# EAGLE design was_not_root_aerialboard_rev1 (EAGLE 6.4)
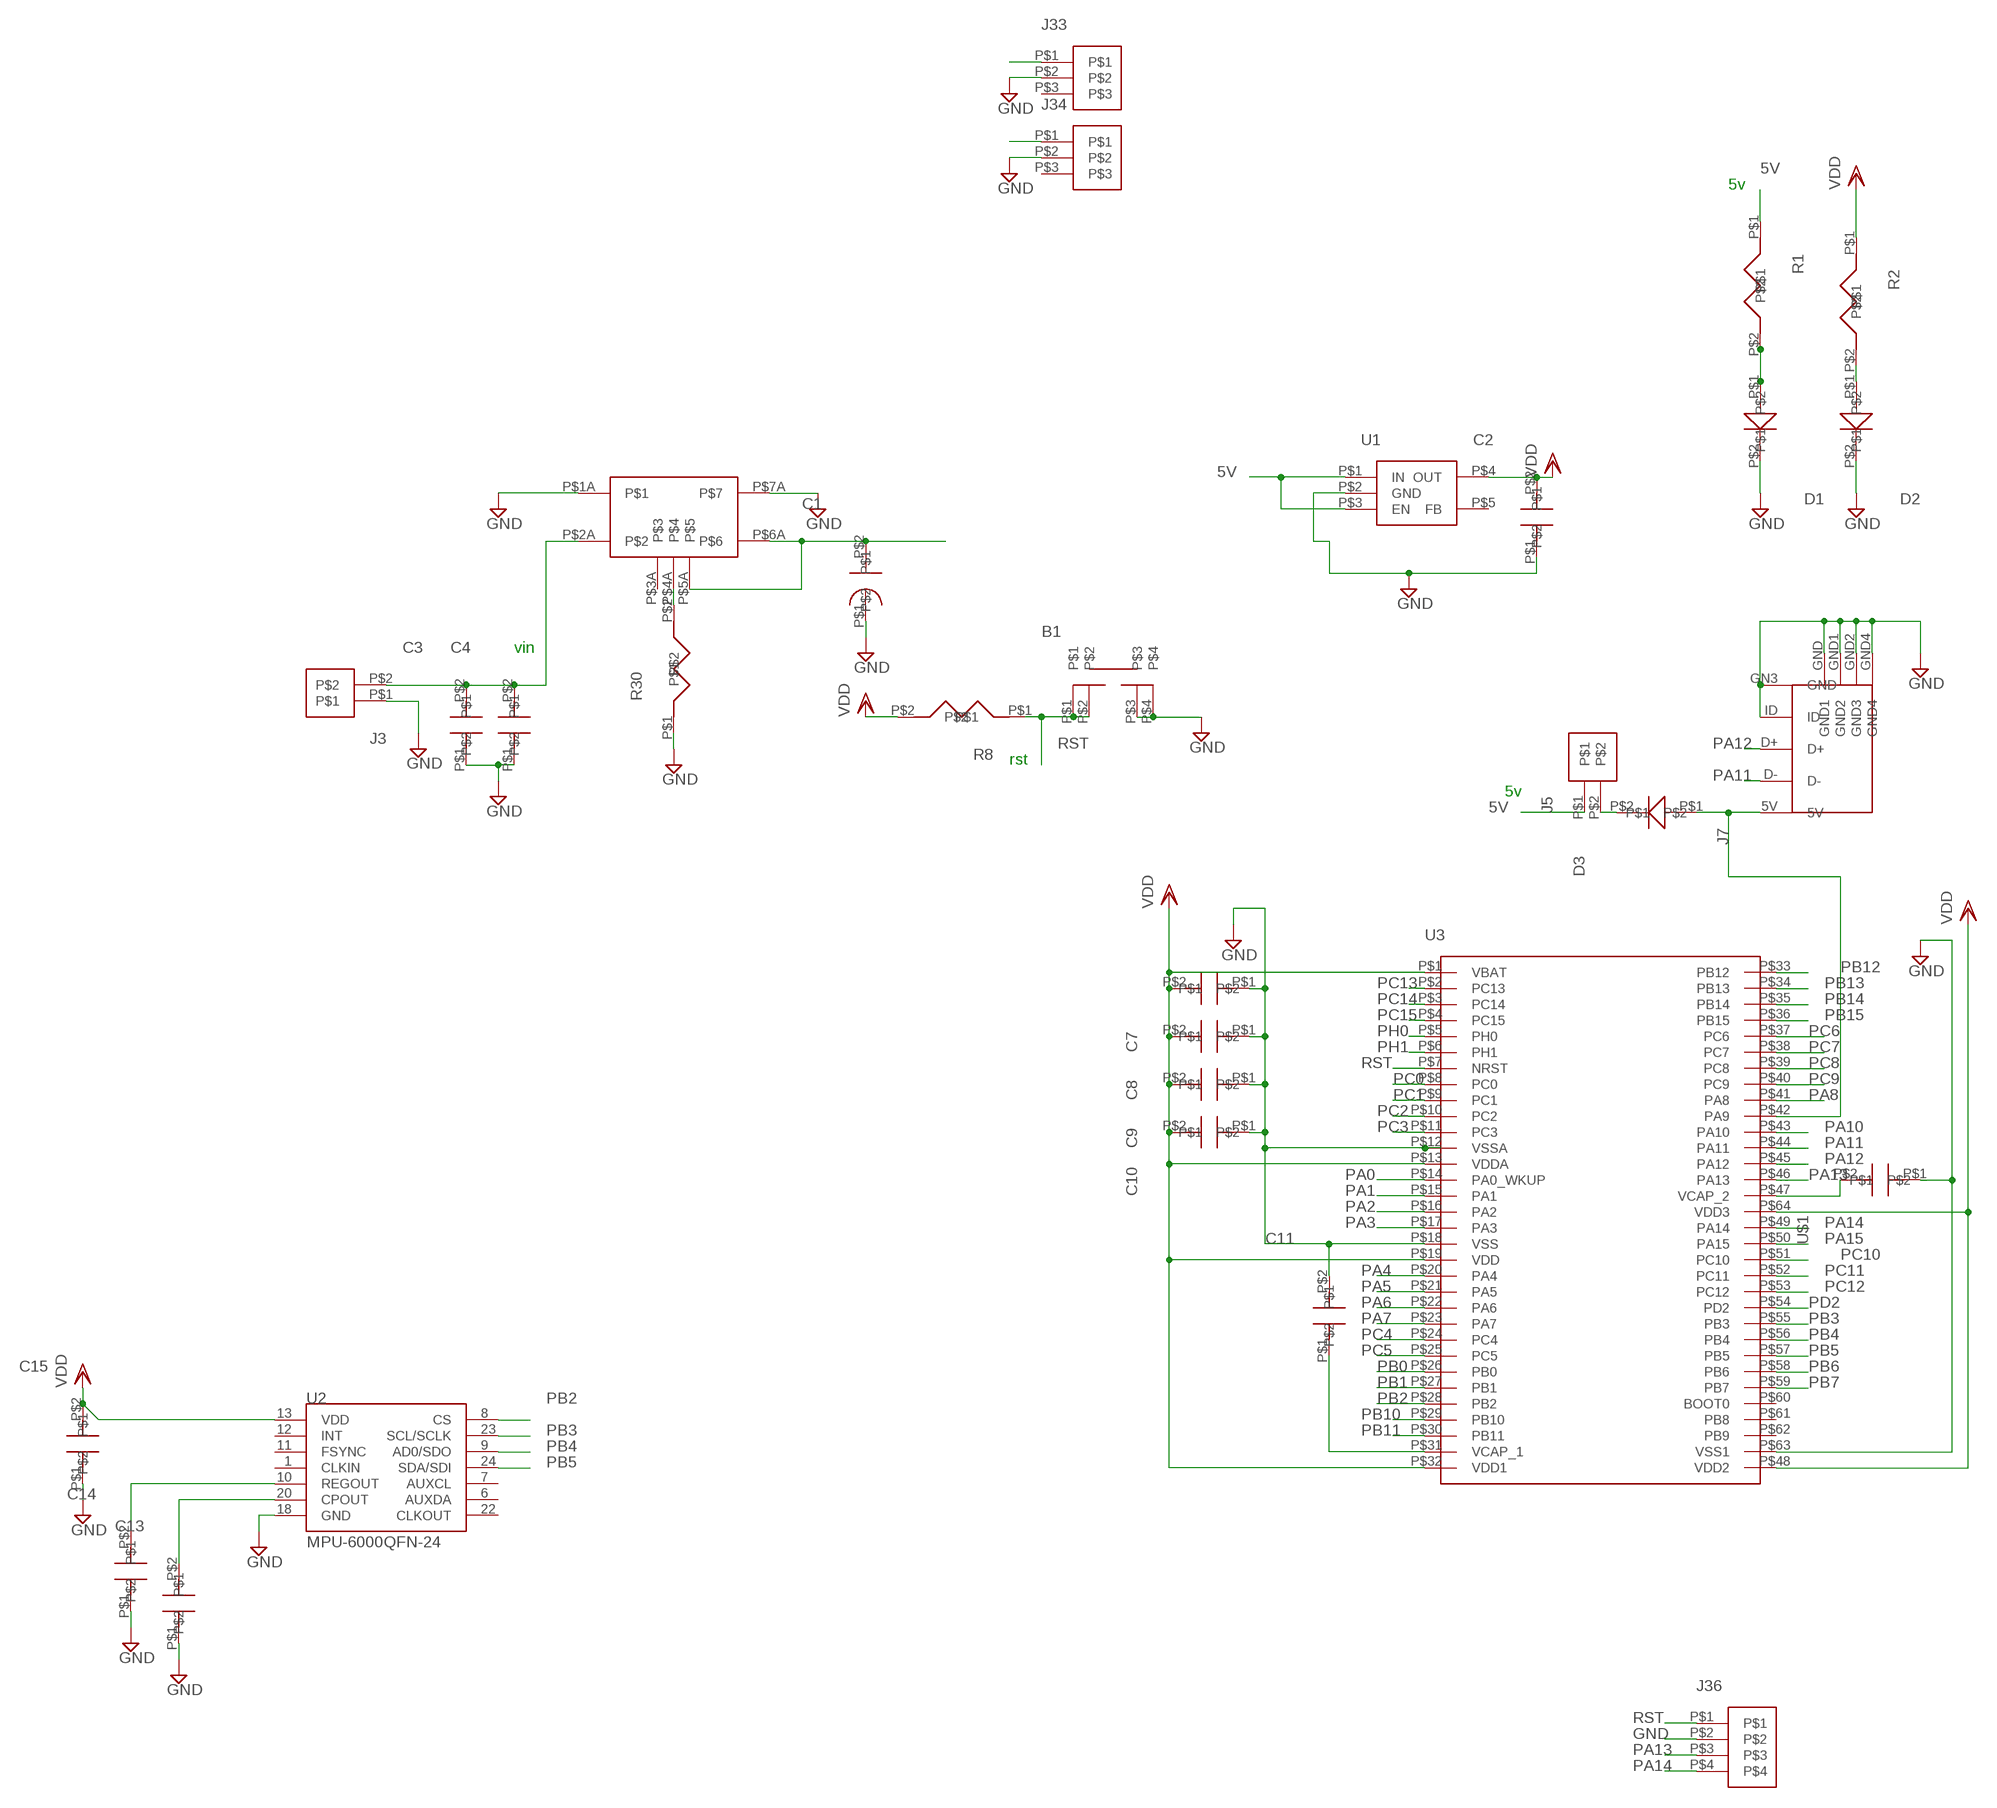
[diagram p0: schematic, sheet 1, part 1 of 2]
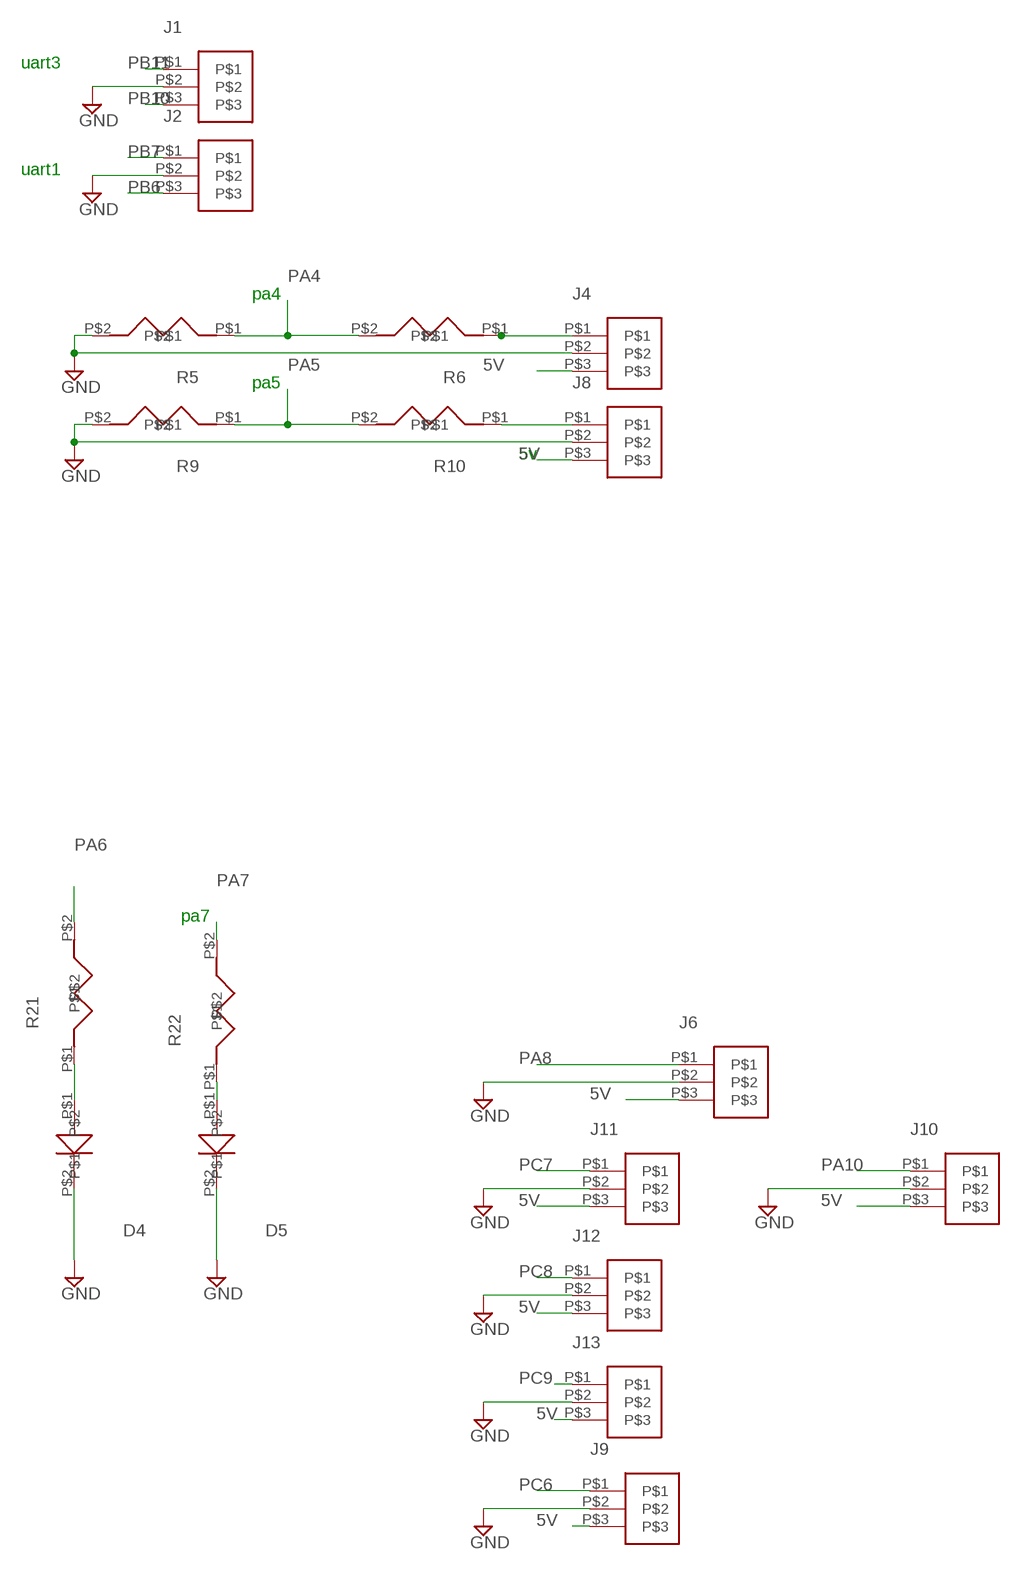
[diagram p1: schematic, sheet 1, part 2 of 2]

## Parts
B1  SM-BUTTON  [SM_BUTTON]
C1  CAPACITOR-330UF  [330UF-CAPACITOR]
C2  2.2UF-CAP  [0603-CAPACITOR]
C3  2.2UF-CAP  [0603-CAPACITOR]
C4  2.2UF-CAP  [0603-CAPACITOR]
C7  CAPACITOR-.1UF-4V  [0603-CAPACITOR]
C8  CAPACITOR-.1UF-4V  [0603-CAPACITOR]
C9  CAPACITOR-.1UF-4V  [0603-CAPACITOR]
C10  4.7UF-CAP6.3V  [0603-CAPACITOR]
C11  2.2UF-CAP  [0603-CAPACITOR]
C13  CAPACITOR-2.2NF-50V  [0603-CAPACITOR]
C14  CAPACITOR-.1UF-4V  [0603-CAPACITOR]
C15  CAPACITOR-.1UF-4V  [0603-CAPACITOR]
D1  RED_LED  [0603-CAPACITOR]
D2  RED_LED  [0603-CAPACITOR]
D3  B240A-DIODE  [DIODE-DS13004]
D4  RED_LED  [0603-CAPACITOR]
D5  ORANGE_LED  [0603-CAPACITOR]
J1  3-PIN-SHERLOCK  [3-PIN-2MM]
J2  3-PIN-SHERLOCK  [3-PIN-2MM]
J3  2-PIN-POWER  [2-PIN-3MM]
J4  3-PIN-SHERLOCK  [3-PIN-2MM]
J5  2-PIN-100MIL  [2PIN-100MIL]
J6  3-PIN-SHERLOCK  [3-PIN-2MM]
J7  USB_MINI_B  [USB_MINI_B]
J8  3-PIN-SHERLOCK  [3-PIN-2MM]
J9  3-PIN-SHERLOCK  [3-PIN-2MM]
J10  3-PIN-SHERLOCK  [3-PIN-2MM]
J11  3-PIN-SHERLOCK  [3-PIN-2MM]
J12  3-PIN-SHERLOCK  [3-PIN-2MM]
J13  3-PIN-SHERLOCK  [3-PIN-2MM]
J33  3-PIN-3MM  [3-PIN-3MM]
J34  3-PIN-3MM  [3-PIN-3MM]
J36  4-PIN-SHERLOCK  [4-PIN-2MM]
R1  RESISTOR-4.7K-25V  [0603-CAPACITOR]
R2  RESISTOR-4.7K-25V  [0603-CAPACITOR]
R5  10K_RESISTOR  [0603-CAPACITOR]
R6  10K_RESISTOR  [0603-CAPACITOR]
R8  RESISTOR-4.7K-25V  [0603-CAPACITOR]
R9  10K_RESISTOR  [0603-CAPACITOR]
R10  10K_RESISTOR  [0603-CAPACITOR]
R21  RESISTOR-4.7K-25V  [0603-CAPACITOR]
R22  RESISTOR-4.7K-25V  [0603-CAPACITOR]
R30  21K_RESISTOR  [0603-CAPACITOR]
U1  TPS73433-3.3-REG  [TPS73433-SOT5]
U2  MPU-6000QFN-24  [QFN-24-TESTING]
U3  STM32F405RG  [LQFP-64-STM32F405]
U$1  2.2UF-CAP  [0603-CAPACITOR]
U$2  WIDE_IN_REG  [WIDE_IN_REG]

## Nets
5V: C1.P$2 J4.P$3 J5.P$1 J6.P$3 J8.P$3 J9.P$3 J10.P$3 J11.P$3 J12.P$3 J13.P$3 J33.P$1 J34.P$1 R1.P$1 U1.P$1(IN) U1.P$3(EN) U$2.P$5A U$2.P$6A
GND: B1.P$3 B1.P$4 C1.P$1 C2.P$1 C3.P$1 C4.P$1 C7.P$1 C8.P$1 C9.P$1 C10.P$1 C11.P$2 C13.P$1 C14.P$1 C15.P$1 D1.P$2 D2.P$2 D4.P$2 D5.P$2 J1.P$2 J2.P$2 J3.P$1 J4.P$2 J6.P$2 J7.GN3(GND) J7.GND1(GND2) J7.GND2(GND3) J7.GND4 J7.GND(GND1) J7.ID J8.P$2 J9.P$2 J10.P$2 J11.P$2 J12.P$2 J13.P$2 J33.P$2 J34.P$2 J36.P$2 R5.P$2 R9.P$2 R30.P$1 U1.P$2(GND) U2.18(GND) U3.P$12(VSSA) U3.P$18(VSS) U3.P$63(VSS1) U$1.P$1 U$2.P$1A U$2.P$7A
N$1: C13.P$2 U2.20(CPOUT)
N$2: D3.P$2 J5.P$2
N$3: J4.P$1 R6.P$1
N$4: D4.P$1 R21.P$1
N$5: R30.P$2 U$2.P$4A
N$6: J8.P$1 R10.P$1
N$7: D5.P$1 R22.P$1
N$8: U3.P$47(VCAP_2) U$1.P$2
N$9: C11.P$1 U3.P$31(VCAP_1)
N$10: D2.P$1 R2.P$2
N$12: D1.P$1 R1.P$2
N$16: C14.P$2 U2.10(REGOUT)
PA0: U3.P$14(PA0_WKUP)
PA1: U3.P$15(PA1)
PA2: U3.P$16(PA2)
PA3: U3.P$17(PA3)
PA4: R5.P$1 R6.P$2 U3.P$20(PA4)
PA5: R9.P$1 R10.P$2 U3.P$21(PA5)
PA6: R21.P$2 U3.P$22(PA6)
PA7: R22.P$2 U3.P$23(PA7)
PA8: J6.P$1 U3.P$41(PA8)
PA9: D3.P$1 J7.5V U3.P$42(PA9)
PA10: J10.P$1 U3.P$43(PA10)
PA11: J7.D- U3.P$44(PA11)
PA12: J7.D+ U3.P$45(PA12)
PA13: J36.P$3 U3.P$46(PA13)
PA14: J36.P$4 U3.P$49(PA14)
PA15: U3.P$50(PA15)
PB0: U3.P$26(PB0)
PB1: U3.P$27(PB1)
PB2: U2.8(CS) U3.P$28(PB2)
PB3: U2.23(SCL/SCLK) U3.P$55(PB3)
PB4: U2.9(AD0/SDO) U3.P$56(PB4)
PB5: U2.24(SDA/SDI) U3.P$57(PB5)
PB6: J2.P$3 U3.P$58(PB6)
PB7: J2.P$1 U3.P$59(PB7)
PB10: J1.P$3 U3.P$29(PB10)
PB11: J1.P$1 U3.P$30(PB11)
PB12: U3.P$33(PB12)
PB13: U3.P$34(PB13)
PB14: U3.P$35(PB14)
PB15: U3.P$36(PB15)
PC0: U3.P$8(PC0)
PC1: U3.P$9(PC1)
PC2: U3.P$10(PC2)
PC3: U3.P$11(PC3)
PC4: U3.P$24(PC4)
PC5: U3.P$25(PC5)
PC6: J9.P$1 U3.P$37(PC6)
PC7: J11.P$1 U3.P$38(PC7)
PC8: J12.P$1 U3.P$39(PC8)
PC9: J13.P$1 U3.P$40(PC9)
PC10: U3.P$51(PC10)
PC11: U3.P$52(PC11)
PC12: U3.P$53(PC12)
PC13: U3.P$2(PC13)
PC14: U3.P$3(PC14)
PC15: U3.P$4(PC15)
PD2: U3.P$54(PD2)
PH0: U3.P$5(PH0)
PH1: U3.P$6(PH1)
RST: B1.P$1 B1.P$2 J36.P$1 R8.P$1 U3.P$7(NRST)
VDD: C2.P$2 C7.P$2 C8.P$2 C9.P$2 C10.P$2 C15.P$2 R2.P$1 R8.P$2 U1.P$4(OUT) U2.13(VDD) U3.P$1(VBAT) U3.P$13(VDDA) U3.P$19(VDD) U3.P$32(VDD1) U3.P$48(VDD2) U3.P$64(VDD3)
VIN: C3.P$2 C4.P$2 J3.P$2 U$2.P$2A
Unconnected: J33.P$3 J34.P$3 U1.P$5(FB) U2.1(CLKIN) U2.6(AUXDA) U2.7(AUXCL) U2.11(FSYNC) U2.12(INT) U2.22(CLKOUT) U3.P$60(BOOT0) U3.P$61(PB8) U3.P$62(PB9) U$2.P$3A

## Notes on the sheet
- 5v
- uart3
- uart1
- vin
- pa4
- pa5
- rst
- 5v
- 5v
- pa7

## Library data of the parts
B1 = aerial:SM-BUTTON
C1 = aerial:CAPACITOR-330UF
C2-C4 C11 U$1 = aerial:2.2UF-CAP
C7-C9 C14 C15 = aerial:CAPACITOR-.1UF-4V
C10 = aerial:4.7UF-CAP6.3V
C13 = aerial:CAPACITOR-2.2NF-50V
D1 D2 D4 = aerial:RED_LED
D3 = aerial:B240A-DIODE
D5 = aerial:ORANGE_LED
J1 J2 J4 J6 J8-J13 = aerial:3-PIN-SHERLOCK
J3 = aerial:2-PIN-POWER
J5 = aerial:2-PIN-100MIL
J7 = aerial:USB_MINI_B
J33 J34 = aerial:3-PIN-3MM
J36 = aerial:4-PIN-SHERLOCK
R1 R2 R8 R21 R22 = aerial:RESISTOR-4.7K-25V
R5 R6 R9 R10 = aerial:10K_RESISTOR
R30 = aerial:21K_RESISTOR
U1 = aerial:TPS73433-3.3-REG
U2 = SparkFun-Sensors:MPU-6000: MPU-6000 - I2C address is 0x68 with AD0 low and 0x69 with AD0 high.
U3 = aerial:STM32F405RG
U$2 = aerial:WIDE_IN_REG

## Board
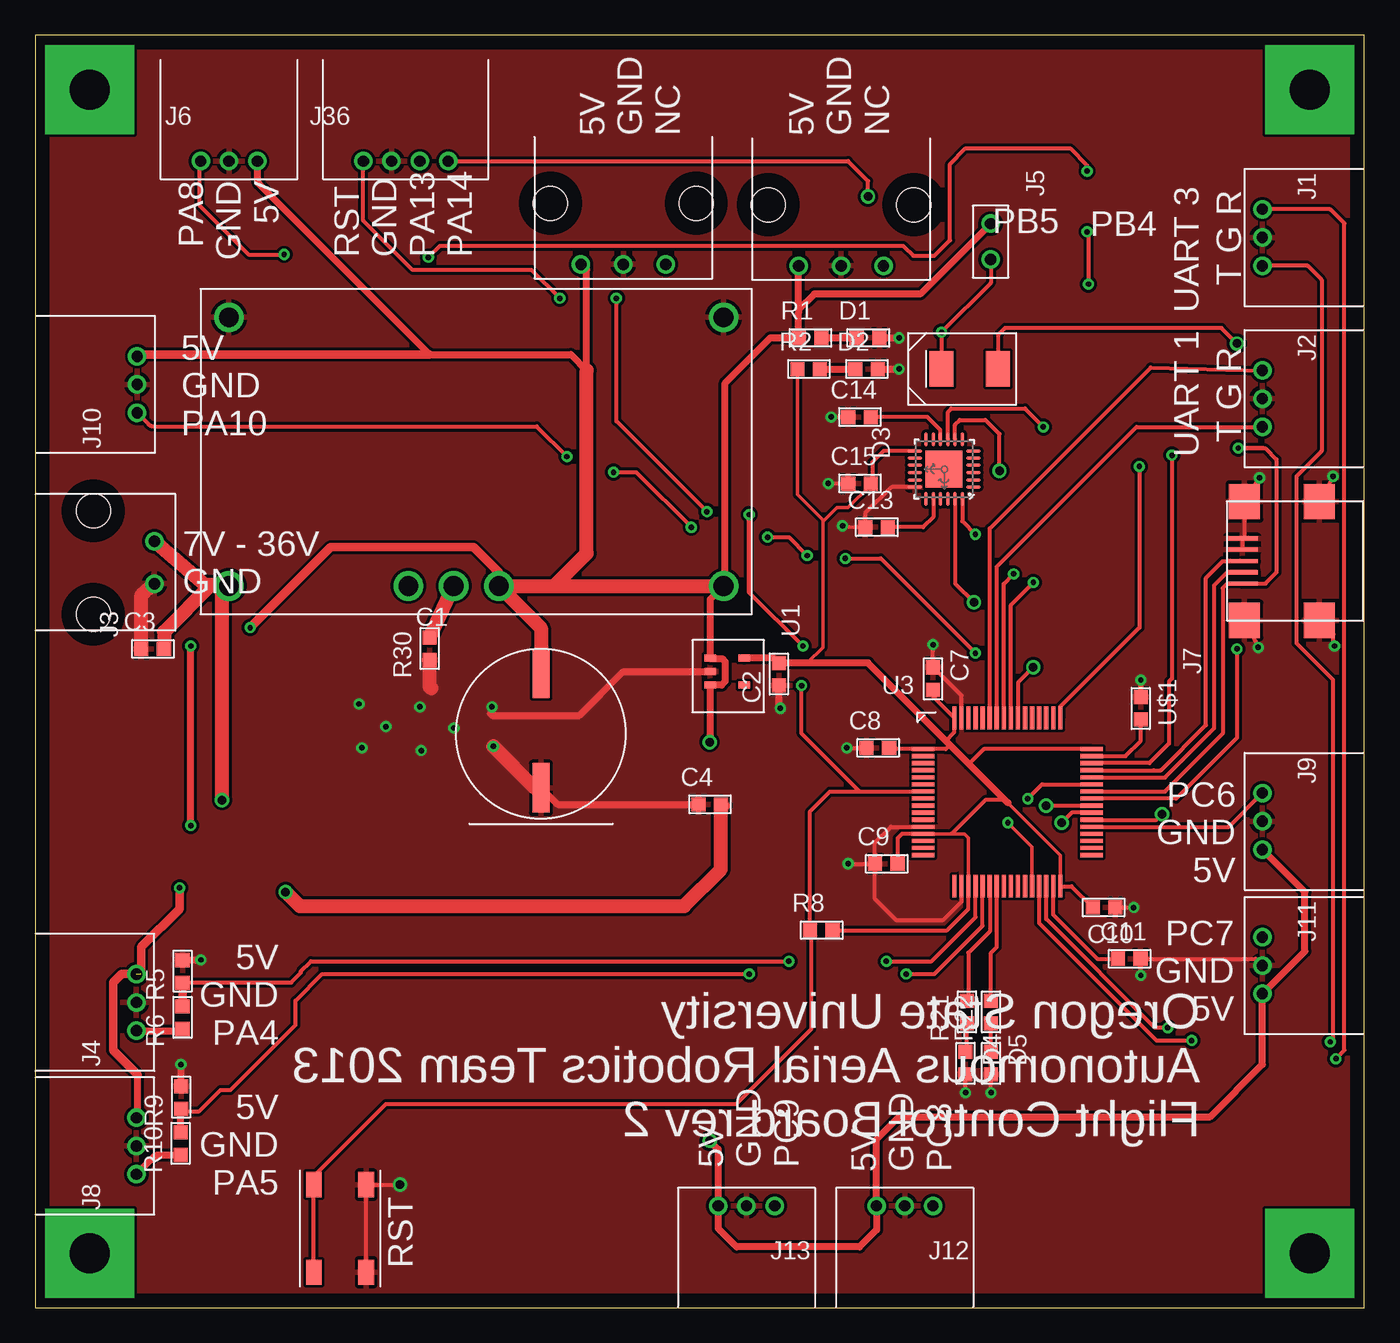
[diagram p2: board, top side]
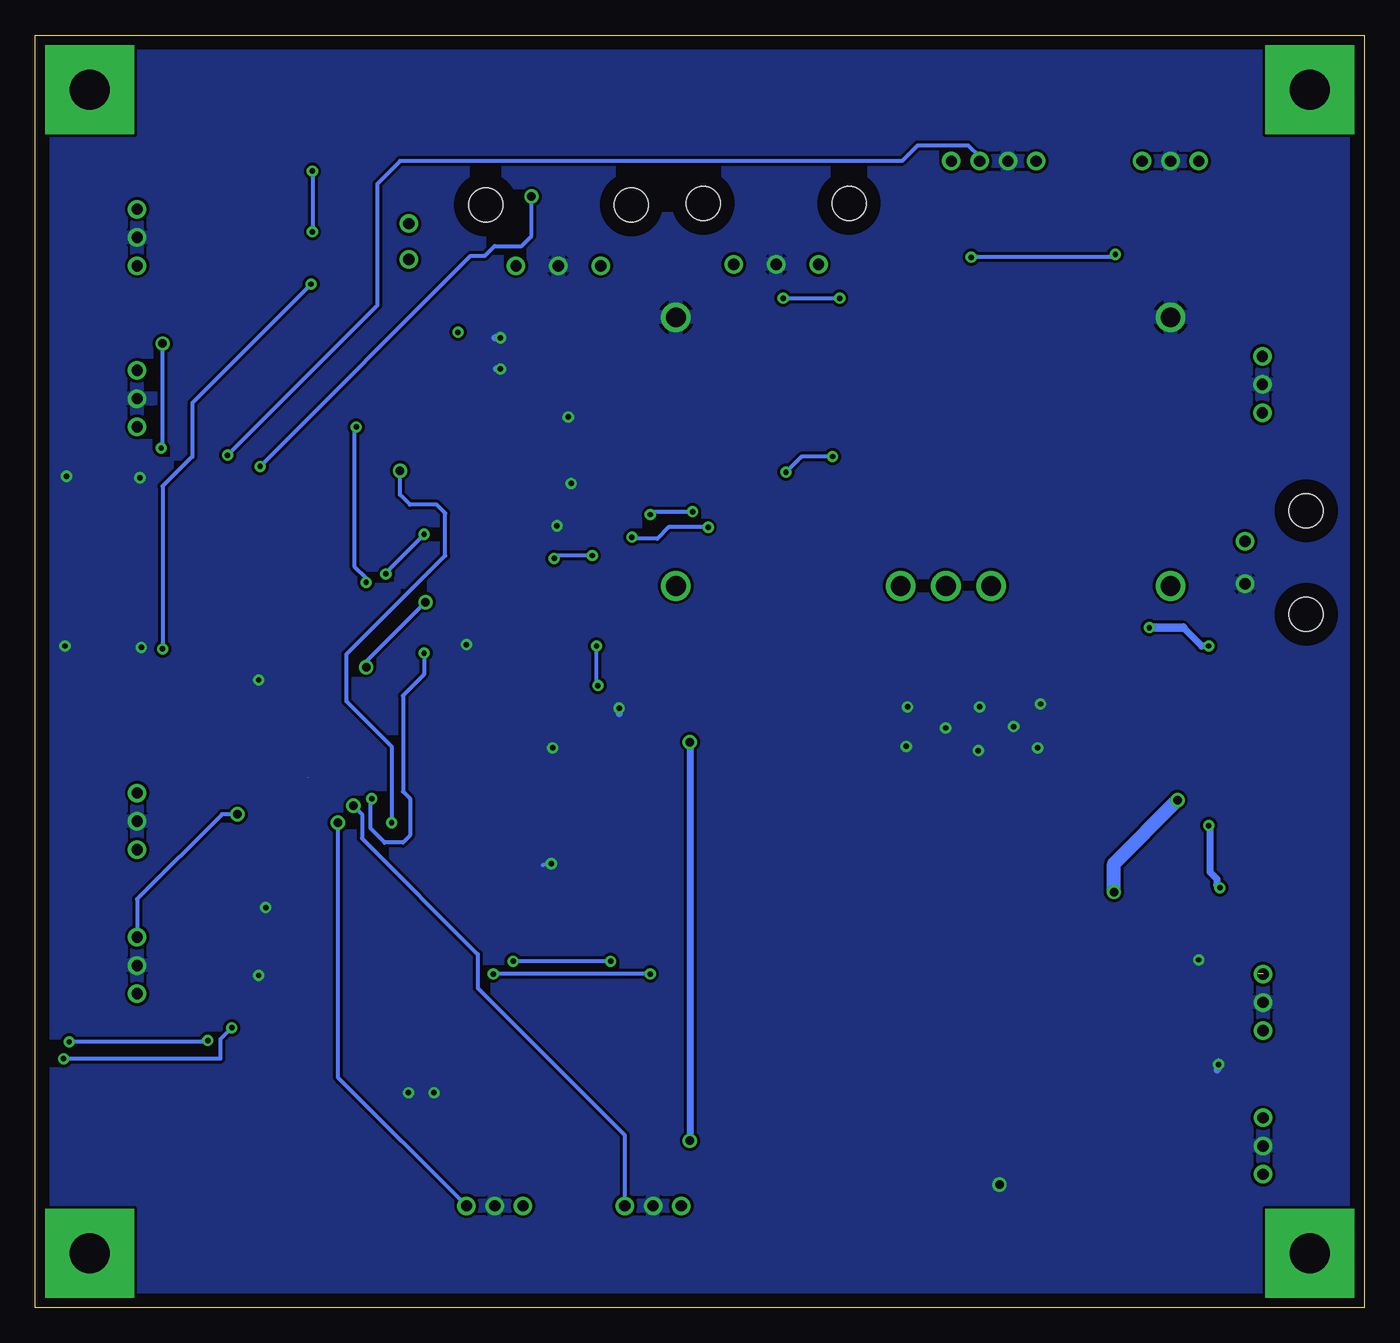
[diagram p3: board, bottom side, seen from below]

Size 94 x 90 mm. Coordinates in mm from the lower left corner, seen from the top.
Outline: 0,0 94,0 94,90 0,90 0,0
Copper layers (1*16): Top 0.035mm / dielectric 1.5mm / Bottom 0.035mm
Design rules "default": minimum track width 10mil, minimum drill 24mil, track to track 8mil, track to pad 8mil, pad to pad 8mil, via to via 8mil, smd to smd 8mil, copper to edge 40mil, drill to drill 8mil, minimum pad ring 10mil, minimum via ring 8mil, stop-mask expansion 4mil, vias tented up to drill 0mil, thermal gap 10mil

### Footprints (pad centres in the part's own frame; a part is rotated, then mirrored left to right if it is on the bottom)
SM_BUTTON = smd 1.8 x 1.1: P$1 0,0; P$2 6.2,0; P$3 0,3.7; P$4 6.2,3.7
330UF-CAPACITOR = smd 1.2 x 3.5: P$1 0,0; P$2 0,8.1
0603-CAPACITOR = smd 1 x 1: P$1 0,0; P$2 1.6,0
DIODE-DS13004 = smd 2.5 x 1.7: P$1 0,0; P$2 0,4
3-PIN-2MM = drill 0.8: P$1 0,0; P$2 2,0; P$3 4,0
2-PIN-3MM = drill 0.8: P$1 0,0; P$2 3,0 | hole 2.41: -2.16,4.32; 5.15,4.32
2PIN-100MIL = drill 0.8: P$1 0,0; P$2 2.54,0
USB_MINI_B = smd 0.3 x 2.2: 5V 2.6,8.55; D+ 4.2,8.55; D- 3.4,8.55; GND 5.8,8.55; ID 5,8.55 | smd 2.5 x 2.2: GN3 8.4,3.1; GND1 0,8.4; GND2 0,3.1; GND4 8.4,8.4
3-PIN-3MM = drill 0.8: P$1 0,0; P$2 3,0; P$3 6,0 | hole 2.41: -2.16,4.32; 8.15,4.32
4-PIN-2MM = drill 0.8: P$1 0,0; P$2 2,0; P$3 4,0; P$4 6,0
TPS73433-SOT5 = smd 0.5 x 0.8: P$1 0,0; P$2 0.95,0; P$3 1.9,0; P$4 0,2.4; P$5 1.9,2.4
QFN-24-TESTING = smd 1.016 x 0.254: 1 -2.066,1.257; 2 -2.066,0.75; 3 -2.066,0.247; 4 -2.066,-0.287; 5 -2.066,-0.792; 6 -2.066,-1.297; 13 2.086,-1.297; 14 2.086,-0.792; 15 2.086,-0.287; 16 2.086,0.247; 17 2.086,0.75; 18 2.086,1.257 | smd 0.254 x 1.016: 7 -1.267,-2.122; 8 -0.762,-2.122; 9 -0.258,-2.122; 10 0.278,-2.122; 11 0.78,-2.122; 12 1.287,-2.122; 19 1.287,2.082; 20 0.78,2.082; 21 0.278,2.082; 22 -0.258,2.082; 23 -0.762,2.082; 24 -1.267,2.082 | smd 2.616 x 2.616: P$1 0.02,-0.01
LQFP-64-STM32F405 = smd 1.6 x 0.3: P$1 0.4,10.1; P$2 0.4,9.6; P$3 0.4,9.1; P$4 0.4,8.6; P$5 0.4,8.1; P$6 0.4,7.6; P$7 0.4,7.1; P$8 0.4,6.6; P$9 0.4,6.1; P$10 0.4,5.6; P$11 0.4,5.1; P$12 0.4,4.6; P$13 0.4,4.1; P$14 0.4,3.6; P$15 0.4,3.1; P$16 0.4,2.6; P$33 12.3,2.6; P$34 12.3,3.1; P$35 12.3,3.6; P$36 12.3,4.1; P$37 12.3,4.6; P$38 12.3,5.1; P$39 12.3,5.6; P$40 12.3,6.1; P$41 12.3,6.6; P$42 12.3,7.1; P$43 12.3,7.6; P$44 12.3,8.1; P$45 12.3,8.6; P$46 12.3,9.1; P$47 12.3,9.6; P$48 12.3,10.1 | smd 0.3 x 1.6: P$17 2.6,0.4; P$18 3.1,0.4; P$19 3.6,0.4; P$20 4.1,0.4; P$21 4.6,0.4; P$22 5.1,0.4; P$23 5.6,0.4; P$24 6.1,0.4; P$25 6.6,0.4; P$26 7.1,0.4; P$27 7.6,0.4; P$28 8.1,0.4; P$29 8.6,0.4; P$30 9.1,0.4; P$31 9.6,0.4; P$32 10.1,0.4; P$49 10.1,12.3; P$50 9.6,12.3; P$51 9.1,12.3; P$52 8.6,12.3; P$53 8.1,12.3; P$54 7.6,12.3; P$55 7.1,12.3; P$56 6.6,12.3; P$57 6.1,12.3; P$58 5.6,12.3; P$59 5.1,12.3; P$60 4.6,12.3; P$61 4.1,12.3; P$62 3.6,12.3; P$63 3.1,12.3; P$64 2.6,12.3
WIDE_IN_REG = drill 1.4: P$1A 2,21; P$2A 2,2; P$3A 14.7,2; P$4A 17.9,2; P$5A 21.1,2; P$6A 37,2; P$7A 37,21

### Placement (x,y rotation side)
B1  19.7,8.7 270 top
C1  35.77,36.77 0 top
C2  52.6,44 90 top
C3  7.5,46.6 0 top
C4  46.9,35.6 0 top
C7  63.5,45.3 270 top
C8  58.8,39.6 0 top
C9  59.4,31.4 0 top
C10  76.4,28.3 180 top
C11  76.58,24.68 0 top
C13  58.7,55.2 0 top
C14  57.5,63 0 top
C15  57.5,58.3 0 top
D1  58.1,68.6 0 top
D2  58,66.4 0 top
D3  68.1,66.4 90 top
D4  65.8,18.1 270 top
D5  67.6,18.1 270 top
J1  86.8,77.7 270 top
J2  86.8,66.3 270 top
J3  8.42,51.21 90 top
J4  7.15,19.59 90 top
J5  67.58,76.68 270 top
J6  11.7,81.1 0 top
J7  93.93,48.62 90 top
J8  7.15,9.43 90 top
J9  86.8,36.4 270 top
J10  7.2,63.3 90 top
J11  86.8,26.2 270 top
J12  63.5,7.2 180 top
J13  52.3,7.2 180 top
J33  54,73.7 0 top
J34  38.6,73.8 0 top
J36  23.2,81.1 0 top
R1  54,68.6 0 top
R2  53.9,66.4 0 top
R5  10.41,22.98 90 top
R6  10.41,19.7 90 top
R8  54.8,26.7 0 top
R9  10.31,14.06 90 top
R10  10.27,10.8 90 top
R21  65.9,20.1 90 top
R22  67.6,20.1 90 top
R30  27.9,45.8 90 top
U1  47.74,45.94 270 top
U2  64.3,59.3 180 top
U3  62.41,29.41 0 top
U$1  78.2,43.2 270 top
U$2  11.69,49.05 0 top

### Tracks (layer width: path | path; a pad name or v marks a point on that pad's centre or on a via)
5V  (via drill 0.38, 0.6)  (2 unrouted)
  Top 0.3: J10.P$3 arc-45 7.49,67.42
  Top 0.5: v11,34.1 v11,46.8 | J6.P$3 15.7,79.83 arc45 15.85,79.47 27.9,67.42 37.88,67.42 39,66.3 39,73.4 J34.P$1 | J8.P$3 arc45 7.25,13.67 7.25,16.45 | v47.7,40 47.74,40.04 U1.P$3 48.54,44.04 48.8,44.3 48.8,45.7 48.6,45.9 47.78,45.9 U1.P$1 47.74,50.1 U$2.P$6A 48.8,51.16 48.8,65.4 52,68.6 R1.P$1 54,70.4 54,70.6 | v47.7,11.8 48.3,11.2 J13.P$3 48.3,5.6 49.6,4.3 58.3,4.3 59.5,5.5 J12.P$3 59.5,11.9 61.1,13.5 83.1,13.5 86.8,17.2 J11.P$3 89.8,25.2 89.8,29.4 J9.P$3 | 54,70.6 J33.P$1 | J5.P$1 62.6,71.7 55.1,71.7 54,70.6
  Top 0.6: U$2.P$5A 32.79,52.01 31,53.8 20.9,53.8 v15.2,48.1 | 7.25,16.45 5.5,18.2 5.5,23 6.1,23.6 7.44,23.6 | 27.9,67.42 7.49,67.42 | v10.2,29.7 10.2,28.2 7.5,25.5 7.5,23.64
  Top 1: C1.P$2 35.77,48.07 U$2.P$5A 36.7,51.05 | 36.7,51.05 U$2.P$6A | 36.7,51.05 39,53.35 39,66.3
  Bottom 0.5: 10.4,29.9 10.4,30.3 10.9,30.8 10.9,34 v11,34.1 | v11,46.8 11.5,46.8 12.8,48.1 | v47.7,40 v47.7,11.8
  Bottom 0.6: 12.8,48.1 v15.2,48.1 | v10.2,29.7 10.4,29.9
GND  (via drill 0.38, 0.6)
  Top 0.25: C14.P$1 v56.3,63 | C15.P$1 v56.1,58.3 | C13.P$1 57.2,55.2 v57.1,55.3
  Top 0.3: U3.P$63 65.51,43.29 C7.P$1 v63.5,46.9 | v57.4,39.6 C8.P$1 | U3.P$12 60.51,34.01 59.4,32.9 C9.P$1 | C10.P$1 v77.7,28.3 | v65.8,15.2 D4.P$2 | v67.6,15.2 D5.P$2 | v57.5,31.4 C9.P$1 | J7.GND1 86.53,46.73 v86.5,46.7 | v91.9,46.8 91.83,46.87 91.83,47.62 J7.GND2 | 86.38,56.87 J7.GND4 | J7.GND4 86.53,58.63 v86.6,58.7 | J7.GN3 91.83,58.77 v91.8,58.8 | B1.P$4 B1.P$3 v25.8,8.7 | v78.2,23.5 78.18,23.52 C11.P$2 86.32,24.68 J11.P$2 | U2.18 60.54,58.04 58.7,56.2 C13.P$1 | U3.P$18 65.51,28.71 64.2,27.4 60.9,27.4 59.4,28.9 C9.P$1 | J7.GND4 85.53,54.57 J7.GND J7.ID
  Top 0.406: U$1.P$1 v78.2,44.4
  Top 0.5: U1.P$2 41.59,44.99 38.5,41.9 32.3,41.9 32.2,42 | C4.P$1 36.94,35.6 C1.P$1 | C2.P$1 52.6,42.5 v52.7,42.4 | D1.P$2 v61.1,68.6 | D2.P$2 v61.1,66.4 | R9.P$2 10.31,16.49 v10.3,17.2 | R5.P$2 11.68,24.58 v11.7,24.6
  Top 1: R30.P$1 27.9,43.9 28,43.8 | C1.P$1 35.33,36.77 v32.4,39.7 | C3.P$1 7.5,50.39 J3.P$1
  Bottom 0.25: v56.3,63 56.1,63 | v56.1,58.3 56,58.3 | v57.1,55.3 57,55.3
  Bottom 0.3: v63.5,46.9 63.5,47.1 | v57.4,39.6 57.2,39.6 | v77.7,28.3 77.8,28.3 | v65.8,15.2 65.8,15 | v67.6,15.2 67.6,15.1 | v57.5,31.4 58.1,31.3 | v86.5,46.7 86.5,46.5 | v91.9,46.8 91.9,46.5 | v86.6,58.7 86.6,58.9 | v91.8,58.8 91.8,58.9 | v78.2,23.5 78.2,23.3
  Bottom 0.406: v78.2,44.4 78.2,44.5
  Bottom 0.5: v52.7,42.4 52.7,42 | v61.1,68.6 61.5,68.6 | v61.1,66.4 61.4,66.4 | v10.3,17.2 10.3,17.4 10.4,16.8 | v11.7,24.6 11.8,24.6
  other vias: 23.1,39.6 22.9,42.7 24.8,41.1 27.3,39.4 27.2,42.5 29.6,41 32.3,42.5
  pour Bottom: 0.5,89.5 93.5,89.5 93.5,0.5 0.5,0.5
  pour Top: 21.4,43.9 33.9,43.9 33.9,38.2 21.4,38.2
  pour Top: 22.2,40.5 22.2,41.6 22.2,42
  pour Top: 0.5,0.5 93.5,0.5 93.5,89.5 0.5,89.5
N$1
  Top 0.3: U2.20 63.52,55.92 62.8,55.2 C13.P$2
N$2  (via drill 0.38)
  Top 0.3: D3.P$2 v64.1,69 67.58,72.48 J5.P$2
  Bottom 0.3: 64.1,69.14 v64.1,69
N$3
  Top 0.5: J4.P$1 10.3,19.59 R6.P$1
N$4
  Top 0.3: R21.P$1 65.9,18.2 D4.P$1
N$5
  Top 1: R30.P$2 U$2.P$4A
N$6
  Top 0.5: J8.P$1 8.37,10.65 arc-45 8.73,10.8 R10.P$1
N$7
  Top 0.3: D5.P$1 R22.P$1
N$8
  Top 0.3: U3.P$47 77.11,39.01 78.2,40.1 U$1.P$2
N$9
  Top 0.3: U3.P$31 72.01,27.79 75.12,24.68 C11.P$1
N$10
  Top 0.5: R2.P$2 D2.P$1
N$12
  Top 0.5: R1.P$2 D1.P$1
N$13  (via drill 2.84 pad 6.3)
  other vias: 3.85,86.15
N$14  (via drill 2.84 pad 6.3)
  other vias: 3.85,3.85
N$16
  Top 0.3: U2.10 64.02,62.08 63.1,63 C14.P$2
N$17  (via drill 2.84 pad 6.3)
  other vias: 90.15,86.15
N$18  (via drill 2.84 pad 6.3)
  other vias: 90.15,3.85
PA4  (via drill 0.38)
  Top 0.3: U3.P$20 66.51,27.61 63.4,24.5 v60.2,24.5 | v53.3,24.5 19.5,24.5 18.78,23.78 18.78,23.68 18.1,23 10.43,23 R5.P$1
  Top 0.6: R6.P$2 R5.P$1
  Bottom 0.3: v53.3,24.5 v60.2,24.5
PA5  (via drill 0.38)
  Top 0.3: U3.P$21 67.01,27.01 63.6,23.6 v61.6,23.6 | v50.5,23.6 20.3,23.6 18.4,21.7 18.4,20 13.8,15.4 13.1,15.4 11.6,13.9 10.35,13.9 R9.P$1
  Top 0.5: R10.P$2 10.27,13.82 R9.P$1
  Bottom 0.3: v50.5,23.6 v61.6,23.6
PA6
  Top 0.3: U3.P$22 67.51,26.61 66,25.1 66,21.8 R21.P$2
PA7
  Top 0.3: U3.P$23 68.01,25.51 67.6,25.1 R22.P$2
PA8  (via drill 0.38)
  Top 0.3: U3.P$41 80.71,36.01 85,40.3 v85,46.6 | v74.5,72.4 74.5,76 v74.4,76.1 | 27.9,74.4 v27.8,74.3 28.6,75.1 61.4,75.1 62.1,74.4 63.6,74.4 64.7,75.5 64.7,80.9 65.8,82 73.2,82 74.4,80.8 v74.4,80.4 | v17.6,74.5 15.09,74.5 11.6,77.99 11.6,80.86 arc-45 J6.P$1
  Bottom 0.3: v85,46.6 85,58.1 82.9,60.2 82.9,64 v74.5,72.4 | v27.8,74.3 17.8,74.3 v17.6,74.5 | v74.4,80.4 v74.4,76.1
PA9  (via drill 0.38, 0.6 pad 0.41)
  Top 0.3: U3.P$42 79.91,36.51 84,40.6 84,50.9 84.32,51.22 J7.5V 87.02,51.22 87.8,52 87.8,60 87,60.8 v85.1,60.8 86.9,60.8 | 67.9,66.6 D3.P$1 68.1,68.8 68.6,69.3 83.9,69.3 v85,68.2
  Bottom 0.3: v85,68.2 85,60.9 v85.1,60.8
PA10  (via drill 0.38)
  Top 0.3: v37.6,60.2 35.46,62.34 8.37,62.34 arc-45 8.01,62.49 J10.P$1 | v40.9,59.1 42.5,59.1 v46.4,55.2 | v51.8,54.5 53.3,54.5 v54.6,53.2 | v57.3,53 59.8,53 v66.5,46.3 | 70.3,36.2 70.2,36.1 v70.2,36 71.21,37.01 U3.P$43
  Bottom 0.3: v37.6,60.2 39.8,60.2 v40.9,59.1 | v46.4,55.2 49.2,55.2 50,54.4 51.7,54.4 v51.8,54.5 | v54.6,53.2 57.1,53.2 v57.3,53 | v66.5,46.3 66.5,44.8 68,43.3 68,36.5 67.5,36 67.5,33.4 68,32.9 69.3,32.9 70.3,33.9 70.3,35.9 v70.2,36
PA11  (1 unrouted)
  Top 0.3: U3.P$44 | U3.P$44 79.9,37.5 83.4,41 83.4,51.1 84.3,52 86.36,52 J7.D-
PA12
  Top 0.3: U3.P$45 79.09,38.01 79.1,38 79.6,38 82.8,41.2 82.8,51.6 84,52.8 86.36,52.8 J7.D+
PA13  (via drill 0.38)
  Top 0.3: U3.P$46 78.81,38.51 80.2,39.9 80.2,44.3 80.4,44.5 v80.4,60.3
  Bottom 0.3: J36.P$3 27.2,81.4 28,82.2 31.6,82.2 32.7,81.1 68.2,81.1 69.8,79.5 69.8,70.9 v80.4,60.3
PA14  (via drill 0.38, 0.6)
  Top 0.3: U3.P$49 72.51,42.51 78.1,48.1 v78.1,59.5 | J36.P$4 57.5,81.1 58.9,79.7 v58.9,78.6
  Bottom 0.3: v78.1,59.5 63.2,74.4 62.2,74.4 61.5,75.1 59.6,75.1 58.9,75.8 v58.9,78.6
PB2  (via drill 0.38, 0.6)
  Top 0.25: U3.P$28 70.51,32.59 v68.8,34.3
  Top 0.3: v68.2,59.2 68.2,61.8 67.2,62.8 65.4,62.8 65.06,62.46 U2.8
  Bottom 0.3: v68.2,59.2 68.2,57.5 67.5,56.8 65.6,56.8 65,56.2 65,53.2 72,46.2 72,42.9 68.8,39.7 v68.8,34.3
PB3  (via drill 0.6)
  Top 0.3: U2.23 65.06,51.24 v66.4,49.9 | v70.6,45.3 69.51,44.21 U3.P$55
  Bottom 0.3: v66.4,49.9 70.6,45.7 v70.6,45.3
PB4  (via drill 0.38)
  Top 0.3: U3.P$56 69.01,49.71 v70.6,51.3 | v71.3,62.3 70,63.6 64.8,63.6 64.56,63.36 U2.9
  Bottom 0.3: v70.6,51.3 70.6,51.6 71.4,52.4 71.4,62.2 v71.3,62.3
PB5  (via drill 0.38)
  Top 0.3: U3.P$57 68.51,51.19 68.5,51.2 v69.2,51.9 | U2.24 65.57,55.63 v66.5,54.7
  Bottom 0.3: v69.2,51.9 69.2,52 v66.5,54.7
PB6
  Top 0.3: U3.P$58 68.01,52.41 77.9,62.3 J2.P$3
PB7
  Top 0.3: U3.P$59 67.51,55.11 78.9,66.5 J2.P$1
PB10  (via drill 0.38)
  Top 0.3: U3.P$29 71.01,27.19 79.3,18.9 v81.8,18.9 | v91.6,18.8 91.8,19 91.8,44.4 89.2,47 89.2,58.8 91,60.6 91,72.7 90,73.7 J1.P$3
  Bottom 0.3: v91.6,18.8 81.9,18.8 v81.8,18.9
PB11  (via drill 0.38)
  Top 0.3: U3.P$30 71.51,27.49 79.2,19.8 v80.1,19.8 | v92,17.6 92.6,18.2 92.6,76.7 91.6,77.7 J1.P$1
  Bottom 0.3: v92,17.6 80.9,17.6 80.9,19 v80.1,19.8
PC6
  Top 0.3: U3.P$37 84.41,34.01 J9.P$1
PC7  (via drill 0.6)
  Top 0.3: U3.P$38 79.31,34.51 v79.7,34.9
  Bottom 0.3: v79.7,34.9 80.8,34.9 86.8,28.9 J11.P$1
PC8  (via drill 0.6)
  Top 0.3: U3.P$39 73.31,35.01 v72.6,34.3
  Bottom 0.3: v72.6,34.3 72.6,16.3 J12.P$1
PC9  (via drill 0.6)
  Top 0.3: U3.P$40 arc-45 74.69,35.5 v71.5,35.5
  Bottom 0.3: J13.P$1 52.3,12.2 62.7,22.6 62.7,25 70.9,33.2 70.9,34.9 v71.5,35.5
RST  (via drill 0.38)
  Top 0.3: B1.P$2 B1.P$1 19.6,9.2 24.8,14.4 49.6,14.4 54.9,19.7 54.9,26.2 R8.P$1 54.8,35.1 56.21,36.51 58.3,36.51 | 58.3,36.51 U3.P$7 | J36.P$1 23.2,76.9 26.7,73.4 35.1,73.4 v37.1,71.4 | v41.1,71.4 41.1,62.7 v47.5,56.3 | v50.5,56.1 50.5,50.6 v54.3,46.8 | v54.2,44 54.2,40.61 58.3,36.51
  Bottom 0.3: v41.1,71.4 v37.1,71.4 | v47.5,56.3 50.3,56.3 v50.5,56.1 | v54.3,46.8 54.3,44.1 v54.2,44
VDD
  Top 0.25: 59.23,58.42 C15.P$2 59.1,58.2 57.5,56.6 56.7,56.6 55.7,55.6 | 55.7,55.6 55.7,46.7 54.6,45.6 | U3.P$13 64.8,33.51 65.71,33.51 66.01,33.21 U3.P$19 | U3.P$32 72.51,31.99 68.8,35.7 | 55.7,55.6 55.7,55.7 53.9,57.5 R2.P$1
  Top 0.3: C7.P$2 63.5,43.22 U3.P$64 65.01,40.71 64.4,40.1 | C8.P$2 60.49,39.51 U3.P$1 64.41,39.51 64.7,39.8 | U3.P$13 61.31,33.51 61,33.2 C9.P$2 | U3.P$32 73.29,29.81 C10.P$2 | U2.13 60.2,60.6 60,60.6 59.2,59.8 59.2,58.4 C15.P$2 | R8.P$2 64.5,26.7 66,28.2 U3.P$19 | 68.6,35.9 67.19,35.9 64.8,33.51 | U3.P$48 67.11,39.51 66.05,38.45
  Top 0.5: U1.P$4 52.26,45.94 C2.P$2 54.6,45.6 58.9,45.6 64.4,40.1 64.7,39.8 66.05,38.45 68.6,35.9 68.8,35.7
VIN  (via drill 0.6)
  Top 1: 48.61,35.49 C4.P$2 48.5,31 45.9,28.4 18.7,28.4 v17.7,29.4 | v13.2,35.9 13.2,50.56 U$2.P$2A 13.64,51.1 12.4,51.1 | C3.P$2 9.1,47.8 12.4,51.1 | 12.4,51.1 12.03,51.1 J3.P$2
  Bottom 1: v17.7,29.4 17.7,31.4 v13.2,35.9

### Text on the board
tPlace: 5V / GND / NC | 5V / GND / NC | PA8 / GND / 5V | PB5 | PB4 | RST / GND / PA13 / PA14 | T G R | UART 3 | 5V / GND / PA10 | T G R | UART 1 | 7V - 36V / GND | PC6 / GND / 5V | PC7 / GND / 5V | 5V / GND / PA4 | 5V / GND / PA5 | Oregon State University / Autonomous Aerial Robotics Team 2013 / Flight Control Board rev 2 | 5V / GND / PC9 | 5V / GND / PC8 | RST